# Altium schematic sheet INTERFACE.SchDoc
size A4; DocumentNumber: 2; SheetNumber: 2; SheetTotal: 6
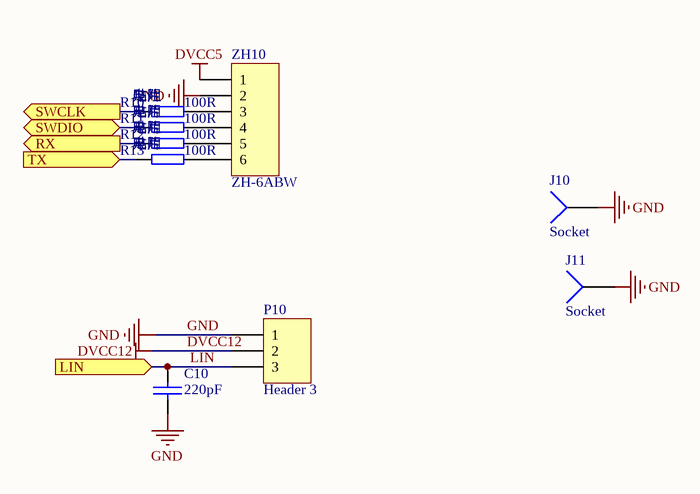
[diagram p0: INTERFACE.SchDoc]

## Parts
C10  220pF  [C0402]
J10  Socket  [SPRING_2SIDES]
J11  Socket  [SPRING_2SIDES]
P10  Header 3  [53426-3]
R10  100R  [R0402]
R11  100R  [R0402]
R12  100R  [R0402]
R13  100R  [R0402]
ZH10  ZH-6ABW  [ZH-6ABW]

## Ports
LIN (in), RX (out), SWCLK (out), SWDIO, TX (in)

## Nets
DVCC5: ZH10.1
DVCC12: P10.2
GND: C10.2 J10.1 J11.1 P10.1 ZH10.2
LIN: C10.1 P10.3 ; port LIN
RX: R12.1 ; port RX
SWCLK: R10.1 ; port SWCLK
SWDIO: R11.1 ; port SWDIO
TX: R13.1 ; port TX
NetR10_2: R10.2 ZH10.3
NetR11_2: R11.2 ZH10.4
NetR12_2: R12.2 ZH10.5
NetR13_2: R13.2 ZH10.6

## Notes on the sheet
- (in symbol RES1) 电阻; 贴片

## Library data of the parts
C10 = CC: 大小: 0.1uf/50v; 封装: 0603
P10 = Header 3: Header, 3-Pin; LatestRevisionDate: 17-Jul-2002; LatestRevisionNote: Re-released for DXP Platform.; Publisher: Altium Limited
R10-R13 = RES1: 价格: 0.01; 封�: 0603; 大小: 10K
ZH10 = ZH-6ABW: 1.5mm; LatestRevisionDate: 17-Jul-2002; LatestRevisionNote: Re-released for DXP Platform.; Publisher: Altium Limited
J10 J11 = Socket: LatestRevisionDate: 17-Jul-2002; LatestRevisionNote: Re-released for DXP Platform.; Publisher: Altium Limited